# Altium schematic sheet 02 CONNECTION.SchDoc
size 420 x 297 mm
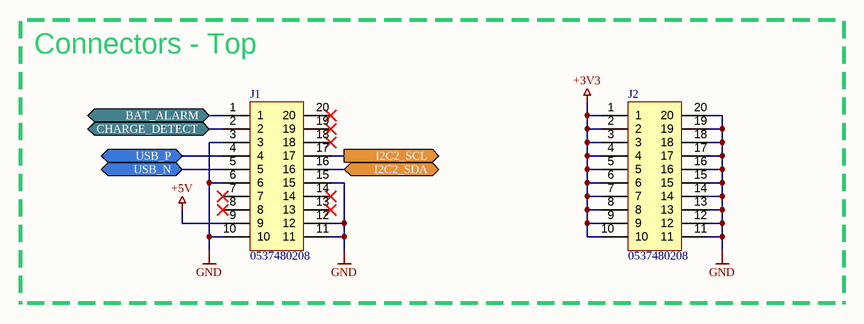
[diagram p0: 02 CONNECTION.SchDoc]

## Parts
J1  0537480208  [0537480208]
J2  0537480208  [0537480208]

## Ports
BAT_ALARM (bidir), CHARGE_DETECT (bidir), I2C2_SCL (out), I2C2_SDA (bidir), USB_N (bidir), USB_P (bidir)

## Nets
+3V3: J2.1 J2.2 J2.3 J2.4 J2.5 J2.6 J2.7 J2.8 J2.9 J2.10
+5V: J1.9
GND: J1.3 J1.6 J1.10 J1.11 J1.12 J1.15 J2.11 J2.12 J2.13 J2.14 J2.15 J2.16 J2.17 J2.18 J2.19 J2.20
BAT_ALARM: J1.1 ; port BAT_ALARM
CHARGE_DETECT: J1.2 ; port CHARGE_DETECT
I2C2_SCL: J1.17 ; port I2C2_SCL
I2C2_SDA: J1.16 ; port I2C2_SDA
USB_N: J1.5 ; port USB_N
USB_P: J1.4 ; port USB_P

Not connected (* = marked no-connect by the designer): J1 7* 8* 13* 14* 18* 19* 20*

## Notes on the sheet
- Connectors - Top
- Title
- Project
- Size
- Date
- Revision
- A3

## Library data of the parts
J1 J2 = 0537480208: CONN PLUG 20POS SMD GOLD; manufacturer: MOLEX; assembler_number: C564063; mfr_part_number: 0537480208; datasheet: https://datasheet.lcsc.com/lcsc/2206301915_MOLEX-537480208_C564063.pdf